# Altium project NODEMCU_DEVKIT_V1.0.PrjPCB
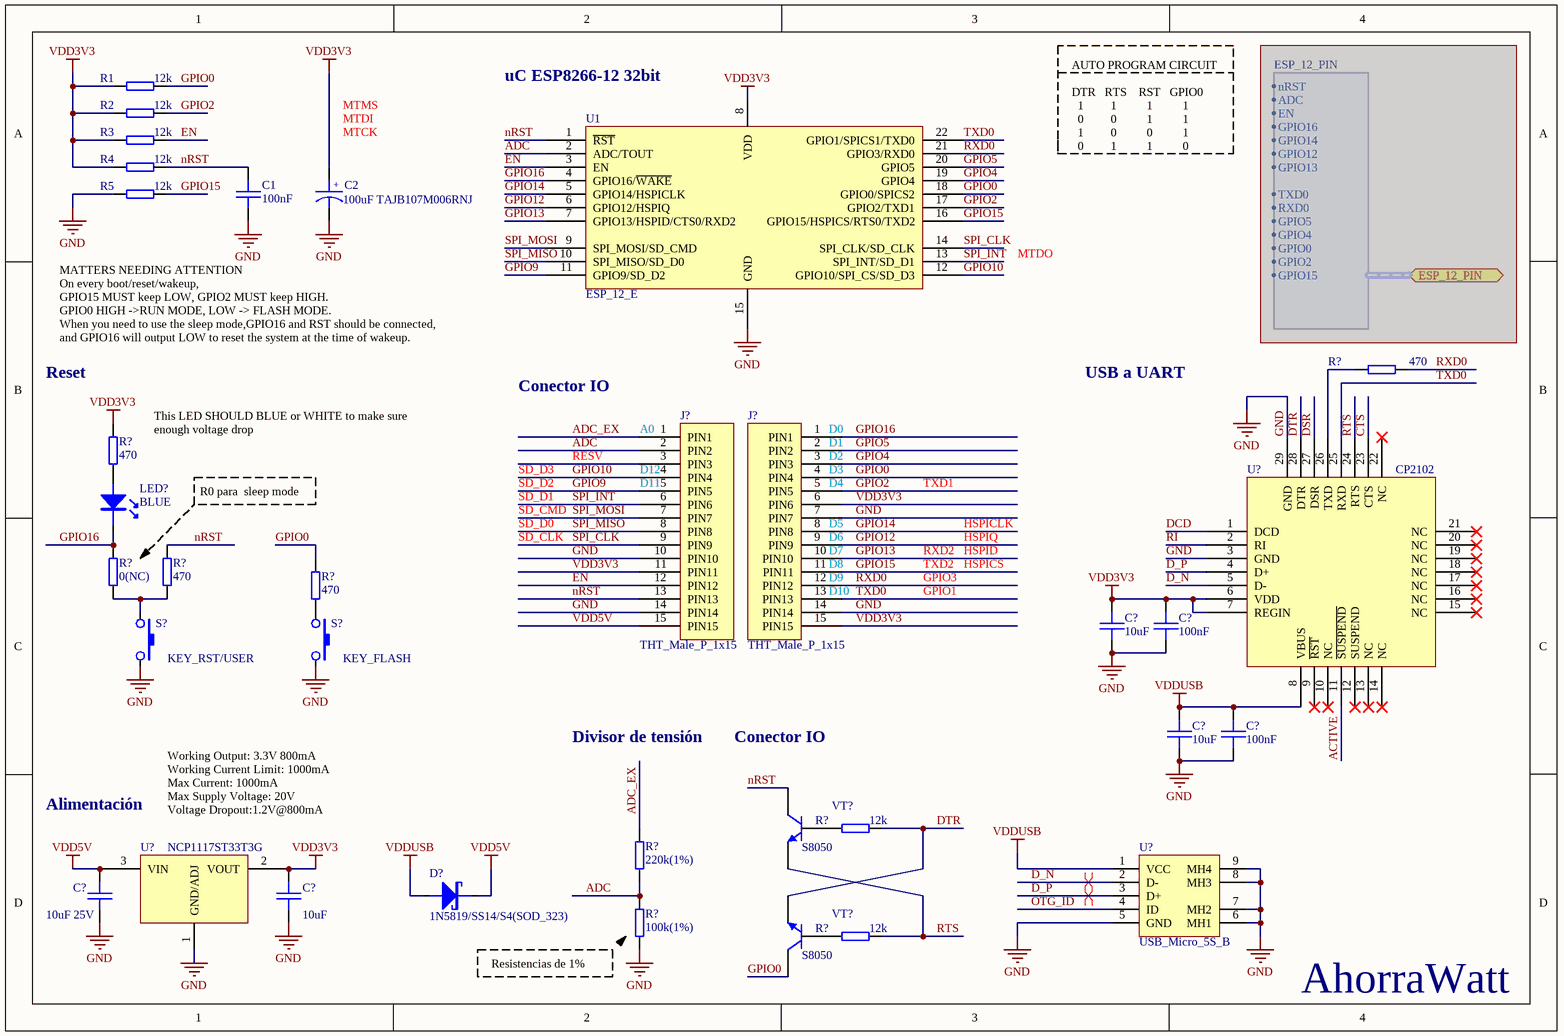
[diagram p0: 02_ESP12_CORE.SchDoc]
1 sheet, 34 parts. Net scope: flat (ports and power ports of the same name join across sheets).
Board file: NODEMCU_DEVKIT_V1.0.PcbDoc

## Sheet 02_ESP12_CORE.SchDoc: ESP-12 CORE
size A4; Date: 20/11/2014; Author: HuangRui <vowstar@gmail.com>; DrawnBy: JiYaping <jyp1817@gmail.com>; Organization: WWW.NODEMCU.COM

### Parts
(Parts that share a designator on the sheet are numbered #1, #2 ... from top to bottom, then left to right.)
C1  100nF  [SMT_C_0402]
C2  100uF TAJB107M006RNJ  [SMT_C_Tantalum_B]
C?#1  10uF  [SMT_C_0402]
C?#2  100nF  [SMT_C_0402]
C?#3  10uF  [SMT_C_0402]
C?#4  100nF  [SMT_C_0402]
C?#5  10uF 25V  [SMT_C_0805]
C?#6  10uF  [SMT_C_0402]
D?  1N5819/SS14/S4(SOD_323)  [SMT_DIODE_SOD_323]
J?#1  THT_Male_P_1x15  [THT_Male_P_1x15-2.54mm]
J?#2  THT_Male_P_1x15  [THT_Male_P_1x15-2.54mm]
LED?  BLUE  [SMT_LED_0603]
R1  12k  [SMT_R_0402]
R2  12k  [SMT_R_0402]
R3  12k  [SMT_R_0402]
R4  12k  [SMT_R_0402]
R5  12k  [SMT_R_0402]
R?#1  470  [SMT_R_0402]
R?#2  470  [SMT_R_0402]
R?#3  0(NC)  [SMT_R_0402]
R?#4  470  [SMT_R_0402]
R?#5  470  [SMT_R_0402]
R?#6  12k  [SMT_R_0402]
R?#7  220k(1%)  [SMT_R_0402]
R?#8  100k(1%)  [SMT_R_0402]
R?#9  12k  [SMT_R_0402]
S?#1  KEY_RST/USER  [SMT_SW_PTS_820]
S?#2  KEY_FLASH  [SMT_SW_PTS_820]
U1  ESP_12_E  [ESP_12_E_L]
U?#1  CP2102  [CP2102]
U?#2  NCP1117ST33T3G  [SOT-223]
U?#3  USB_Micro_5S_B  [USB_MICRO_5S_B]
VT?#1  S8050  [SMT_TRIODE_NPN]
VT?#2  S8050  [SMT_TRIODE_NPN]

### Ports
ESP_12_PIN (harness ESP_12_PIN)

### Harnesses
ESP_12_PIN: nRST, ADC, EN, GPIO16, GPIO12, GPIO13, GPIO14, TXD0, RXD0, GPIO4, GPIO5, GPIO0, GPIO2, GPIO15

### Nets
GND: C1.2 C2.2 C?#1.2 C?#2.2 C?#3.2 C?#4.2 C?#5.2 C?#6.2 J?#1.10(PIN10) J?#1.14(PIN14) J?#2.7(PIN7) J?#2.14(PIN14) R5.1 R?#8.1 S?#1.2 S?#2.2 U1.15(GND) U?#1.3(GND) U?#1.29(GND) U?#2.1(GND/ADJ) U?#3.5(GND) U?#3.6(MH1) U?#3.7(MH2) U?#3.8(MH3) U?#3.9(MH4)
VDD3V3: C2.1 C?#1.1 C?#2.1 C?#6.1 J?#1.11(PIN11) J?#2.6(PIN6) J?#2.15(PIN15) R1.1 R2.1 R3.1 R4.1 R?#2.2 U1.8(VDD) U?#1.6(VDD) U?#1.7(REGIN) U?#2.2(VOUT)
VDD5V: C?#5.1 D?.2(K) J?#1.15(PIN15) U?#2.3(VIN)
VDDUSB: C?#3.1 C?#4.1 D?.1(A) U?#1.8(VBUS) U?#3.1(VCC)
ACTIVE: U?#1.11(~{SUSPEND})
ADC: J?#1.2(PIN2) R?#7.1 R?#8.2 U1.2(ADC/TOUT)
ADC_EX: J?#1.1(PIN1) R?#7.2
CTS: U?#1.23(CTS)
D_N: U?#1.5(D-) U?#3.2(D-)
D_P: U?#1.4(D+) U?#3.3(D+)
DCD: U?#1.1(DCD)
DSR: U?#1.27(DSR)
DTR: R?#6.2 U?#1.28(DTR) VT?#2.2(E)
EN: J?#1.12(PIN12) R3.2 U1.3(EN)
GPIO0: J?#2.4(PIN4) R1.2 R?#5.2 U1.18(GPIO0/SPICS2) VT?#2.3(C)
GPIO2: J?#2.5(PIN5) R2.2 U1.17(GPIO2/TXD1)
GPIO4: J?#2.3(PIN3) U1.19(GPIO4)
GPIO5: J?#2.2(PIN2) U1.20(GPIO5)
GPIO9: J?#1.5(PIN5) U1.11(GPIO9/SD_D2)
GPIO10: J?#1.4(PIN4) U1.12(GPIO10/SPI_CS/SD_D3)
GPIO12: J?#2.9(PIN9) U1.6(GPIO12/HSPIQ)
GPIO13: J?#2.10(PIN10) U1.7(GPIO13/HSPID/CTS0/RXD2)
GPIO14: J?#2.8(PIN8) U1.5(GPIO14/HSPICLK)
GPIO15: J?#2.11(PIN11) R5.2 U1.16(GPIO15/HSPICS/RTS0/TXD2)
GPIO16: J?#2.1(PIN1) LED?.2(K) R?#3.2 U1.4(GPIO16/~{WAKE})
nRST: C1.1 J?#1.13(PIN13) R4.2 R?#4.2 U1.1(~{RST}) VT?#1.3(C)
OTG_ID: U?#3.4(ID)
RI: U?#1.2(RI)
RTS: R?#9.2 U?#1.24(RTS) VT?#1.2(E)
RXD0: J?#2.12(PIN12) R?#1.2 U1.21(GPIO3/RXD0)
SPI_CLK: J?#1.9(PIN9) U1.14(SPI_CLK/SD_CLK)
SPI_INT: J?#1.6(PIN6) U1.13(SPI_INT/SD_D1)
SPI_MISO: J?#1.8(PIN8) U1.10(SPI_MISO/SD_D0)
SPI_MOSI: J?#1.7(PIN7) U1.9(SPI_MOSI/SD_CMD)
TXD0: J?#2.13(PIN13) U1.22(GPIO1/SPICS1/TXD0) U?#1.25(RXD)
NetLED?_1: LED?.1(A) R?#2.1
NetR?#1_1: R?#1.1 U?#1.26(TXD)
NetR?#3_1: R?#3.1 R?#4.1 S?#1.1
NetR?#5_1: R?#5.1 S?#2.1
NetR?#6_1: R?#6.1 VT?#1.1(B)
NetR?#9_1: R?#9.1 VT?#2.1(B)

Not connected (* = marked no-connect by the designer): J?#1 3(PIN3); U?#1 9(~{RST})* 10(NC)* 12(SUSPEND)* 13(NC)* 14(NC)* 15(NC)* 16(NC)* 17(NC)* 18(NC)* 19(NC)* 20(NC)* 21(NC)* 22(NC)*

### Layout directives
differential pair: D_N, D_P

### Notes on the sheet
- MTMS
- (near U1) uC ESP8266-12 32bit
- (near C2) MTCK
- MTDI
- AUTO PROGRAM CIRCUIT
  DTR   RTS    RST   GPIO0
  1         1          1          1
  0         0          1          1
  1         0          0          1
  0         1          1          0
- MTDO
- Reset
- MATTERS NEEDING ATTENTION
  On every boot/reset/wakeup,
  GPIO15 MUST keep LOW, GPIO2 MUST keep HIGH.
  GPIO0 HIGH ->RUN MODE, LOW -> FLASH MODE.
  When you need to use the sleep mode,GPIO16 and RST should be connected,
  and GPIO16 will output LOW to reset the system at the time of wakeup.
- USB a UART
- This LED SHOULD BLUE or WHITE to make sure enough voltage drop
- Conector IO
- (near J?#1) A0
- (near J?#2) D0
- (near J?#2) D1
- R0 para  sleep mode
- SD_CMD
- SD_D1
- SD_D3
- SD_D2
- RESV
- (near J?#1) D12
- (near J?#1) D11
- (near J?#2) D2
- (near J?#2) D3
- (near J?#2) D4
- TXD1
- SD_CLK
- SD_D0
- (near J?#2) D5
- (near J?#2) D6
- (near J?#2) D7
- (near J?#2) D8
- (near J?#2) D9
- TXD2
- RXD2
- GPIO3
- HSPICLK
- HSPIQ
- HSPID
- HSPICS
- (near J?#2) D10
- GPIO1
- Divisor de tensión
- Alimentación
- Working Output: 3.3V 800mA
  Working Current Limit: 1000mA
  Max Current: 1000mA
  Max Supply Voltage: 20V
  Voltage Dropout:1.2V@800mA
- Resistencias de 1%
- AhorraWatt
- (in symbol SMT_C_Tantalum_B) +

### Library data of the parts
C1 C?#1-C?#4 C?#6 = SMT_C_0402: Surface mount capacitor 0402
C2 = SMT_C_Tantalum_B: Capacitor, SM Tantalum; Body 3.5 x 2.8 mm (LxW typ)
C?#5 = SMT_C_0805: Surface mount capacitor 0805
D? = SMT_DIODE_SCHOTTKY_SOD_323: Surface mount schottky diode SOD-323(0805) Package
J?#1 J?#2 = THT_Male_P_1x15: THT Male pin header strip 1x15
LED? = SMT_LED_0603: SMT LED
R1-R5 R?#1-R?#9 = SMT_R_0402: Surface mount resistor 0402
S?#1 S?#2 = SMT_SW_PTS_820: SMT Tactile ‎Switch PTS 820 Series
U1 = ESP_12_E: ESP-12 Wi-Fi Module by AI-Thinker; IC: ESP8266-EX; Vendor: Ai-thinker
U?#2 = NCP1117: NCP1117, NCV1117. 1.0 A Low-Dropout Positive  Fixed and Adjustable  Voltage Regulators
U?#3 = USB_Micro_5S_B: USB micro female SMT with 4 fixed foot
VT?#1 VT?#2 = SMT_TRIODE_NPN: Surface mount NPN transistor, package SOT-23